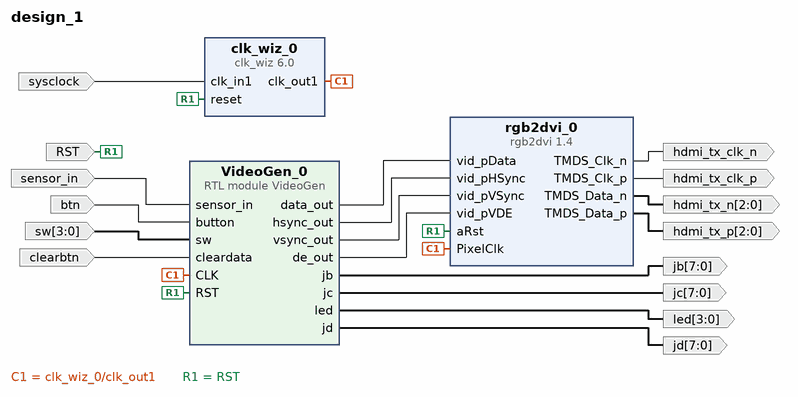
[diagram p0: block diagram of the top level]
# Vivado block design design_1, xc7z020clg400-1, Vivado 2019.2
create_bd_design design_1

create_bd_port -dir O -from 2 -to 0 hdmi_tx_p
create_bd_port -dir O -from 2 -to 0 hdmi_tx_n
create_bd_port -dir O hdmi_tx_clk_n
create_bd_port -dir O hdmi_tx_clk_p
create_bd_port -dir I sysclock
create_bd_port -dir O -from 3 -to 0 led
create_bd_port -dir I sensor_in
create_bd_port -dir I btn
create_bd_port -dir O -from 7 -to 0 jb
create_bd_port -dir O -from 7 -to 0 jc
create_bd_port -dir O -from 7 -to 0 jd
create_bd_port -dir I -from 3 -to 0 sw
create_bd_port -dir I clearbtn
create_bd_port -dir I RST

create_bd_cell -type ip -vlnv digilentinc.com:ip:rgb2dvi:1.4 rgb2dvi_0
set_property -dict {CONFIG.kClkRange 1 CONFIG.kRstActiveHigh true} [get_bd_cells rgb2dvi_0]
create_bd_cell -type ip -vlnv xilinx.com:ip:clk_wiz:6.0 clk_wiz_0
set_property -dict [list \
  CONFIG.CLKOUT1_JITTER 216.859 \
  CONFIG.CLKOUT1_PHASE_ERROR 245.344 \
  CONFIG.CLKOUT1_REQUESTED_OUT_FREQ 148.5 \
  CONFIG.CLK_IN1_BOARD_INTERFACE sys_clock \
  CONFIG.MMCM_CLKFBOUT_MULT_F 37.125 \
  CONFIG.MMCM_CLKOUT0_DIVIDE_F 6.250 \
  CONFIG.MMCM_DIVCLK_DIVIDE 5 \
  CONFIG.RESET_PORT reset \
  CONFIG.RESET_TYPE ACTIVE_HIGH \
  CONFIG.USE_BOARD_FLOW true \
  CONFIG.USE_LOCKED false \
  CONFIG.USE_RESET true \
] [get_bd_cells clk_wiz_0]
create_bd_cell -type module -reference VideoGen VideoGen_0

# ---- connections ----

connect_bd_net [get_bd_pins rgb2dvi_0/TMDS_Data_p] [get_bd_ports hdmi_tx_p]
connect_bd_net [get_bd_pins rgb2dvi_0/TMDS_Data_n] [get_bd_ports hdmi_tx_n]
connect_bd_net [get_bd_pins rgb2dvi_0/TMDS_Clk_p] [get_bd_ports hdmi_tx_clk_p]
connect_bd_net [get_bd_pins rgb2dvi_0/TMDS_Clk_n] [get_bd_ports hdmi_tx_clk_n]
connect_bd_net [get_bd_pins VideoGen_0/data_out] [get_bd_pins rgb2dvi_0/vid_pData]
connect_bd_net [get_bd_pins VideoGen_0/hsync_out] [get_bd_pins rgb2dvi_0/vid_pHSync]
connect_bd_net [get_bd_pins VideoGen_0/vsync_out] [get_bd_pins rgb2dvi_0/vid_pVSync]
connect_bd_net [get_bd_pins VideoGen_0/de_out] [get_bd_pins rgb2dvi_0/vid_pVDE]
connect_bd_net [get_bd_ports sysclock] [get_bd_pins clk_wiz_0/clk_in1]
connect_bd_net [get_bd_pins clk_wiz_0/clk_out1] [get_bd_pins rgb2dvi_0/PixelClk] [get_bd_pins VideoGen_0/CLK]
connect_bd_net [get_bd_pins VideoGen_0/led] [get_bd_ports led]
connect_bd_net [get_bd_ports sensor_in] [get_bd_pins VideoGen_0/sensor_in]
connect_bd_net [get_bd_ports btn] [get_bd_pins VideoGen_0/button]
connect_bd_net [get_bd_pins VideoGen_0/jb] [get_bd_ports jb]
connect_bd_net [get_bd_pins VideoGen_0/jc] [get_bd_ports jc]
connect_bd_net [get_bd_pins VideoGen_0/jd] [get_bd_ports jd]
connect_bd_net [get_bd_ports sw] [get_bd_pins VideoGen_0/sw]
connect_bd_net [get_bd_ports clearbtn] [get_bd_pins VideoGen_0/cleardata]
connect_bd_net -net xlconstant_0_dout [get_bd_ports RST] [get_bd_pins rgb2dvi_0/aRst] [get_bd_pins clk_wiz_0/reset] [get_bd_pins VideoGen_0/RST]

validate_bd_design
save_bd_design
